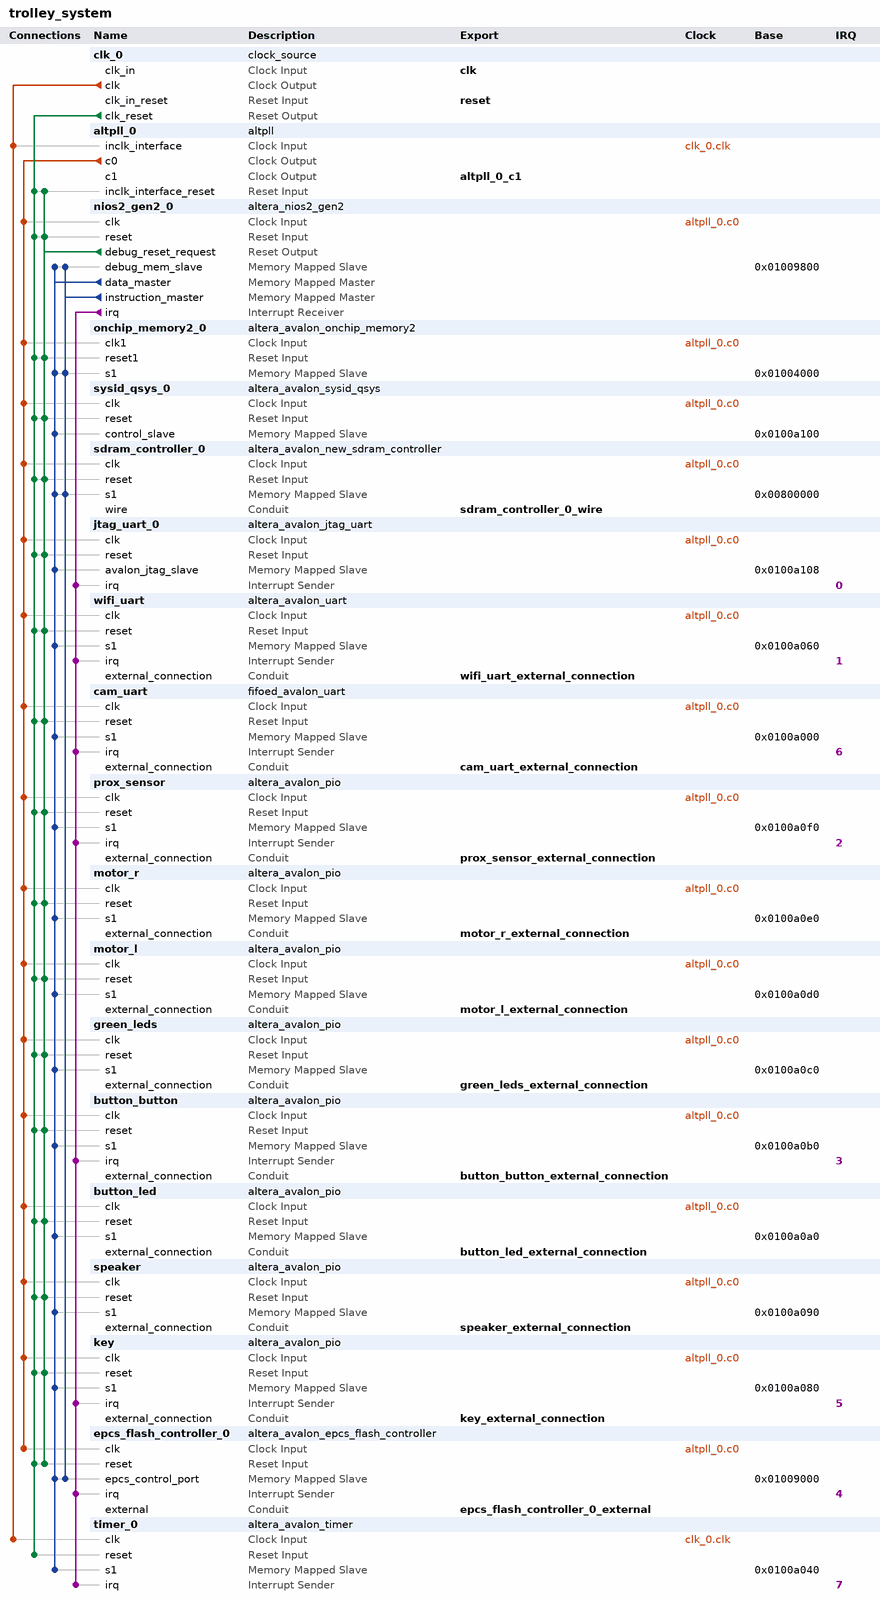
[diagram p0: system contents]
# Platform Designer (Qsys) system trolley_system, Cyclone IV E EP4CE22F17C6
# Parameters at their usual value, and those the tool derives, are not listed.
package require -exact qsys 16.1
create_system trolley_system
set_project_property DEVICE_FAMILY {Cyclone IV E}
set_project_property DEVICE EP4CE22F17C6

add_instance clk_0 clock_source 16.1
set_instance_parameter_value clk_0 clockFrequency 50000000

add_instance altpll_0 altpll 16.1
set_instance_parameter_value altpll_0 CLK0_DIVIDE_BY 1
set_instance_parameter_value altpll_0 CLK0_MULTIPLY_BY 1
set_instance_parameter_value altpll_0 CLK1_DIVIDE_BY 1
set_instance_parameter_value altpll_0 CLK1_DUTY_CYCLE 50
set_instance_parameter_value altpll_0 CLK1_MULTIPLY_BY 1
set_instance_parameter_value altpll_0 CLK1_PHASE_SHIFT -3000
set_instance_parameter_value altpll_0 COMPENSATE_CLOCK CLK1
set_instance_parameter_value altpll_0 INCLK0_INPUT_FREQUENCY 20000
set_instance_parameter_value altpll_0 PORT_ARESET PORT_UNUSED
set_instance_parameter_value altpll_0 PORT_LOCKED PORT_UNUSED
set_instance_parameter_value altpll_0 PORT_clk1 PORT_USED
set_instance_parameter_value altpll_0 PORT_clk2 PORT_UNUSED
set_instance_parameter_value altpll_0 PORT_clk3 PORT_UNUSED

add_instance nios2_gen2_0 altera_nios2_gen2 16.1
set_instance_parameter_value nios2_gen2_0 dcache_size 2048
set_instance_parameter_value nios2_gen2_0 exceptionSlave onchip_memory2_0.s1
set_instance_parameter_value nios2_gen2_0 icache_size 4096
set_instance_parameter_value nios2_gen2_0 impl Tiny
set_instance_parameter_value nios2_gen2_0 resetSlave epcs_flash_controller_0.epcs_control_port

add_instance onchip_memory2_0 altera_avalon_onchip_memory2 16.1
set_instance_parameter_value onchip_memory2_0 dataWidth 32
set_instance_parameter_value onchip_memory2_0 dualPort false
set_instance_parameter_value onchip_memory2_0 initMemContent true
set_instance_parameter_value onchip_memory2_0 initializationFileName onchip_mem.hex
set_instance_parameter_value onchip_memory2_0 memorySize 16384

add_instance sysid_qsys_0 altera_avalon_sysid_qsys 16.1
set_instance_parameter_value sysid_qsys_0 id 0

add_instance sdram_controller_0 altera_avalon_new_sdram_controller 16.1
set_instance_parameter_value sdram_controller_0 TAC 5.5
set_instance_parameter_value sdram_controller_0 TRCD 20.0
set_instance_parameter_value sdram_controller_0 TRP 20.0
set_instance_parameter_value sdram_controller_0 casLatency 3
set_instance_parameter_value sdram_controller_0 columnWidth 8
set_instance_parameter_value sdram_controller_0 dataWidth 16
set_instance_parameter_value sdram_controller_0 generateSimulationModel false
set_instance_parameter_value sdram_controller_0 model single_Micron_MT48LC4M32B2_7_chip
set_instance_parameter_value sdram_controller_0 numberOfBanks 4
set_instance_parameter_value sdram_controller_0 numberOfChipSelects 1
set_instance_parameter_value sdram_controller_0 powerUpDelay 100.0
set_instance_parameter_value sdram_controller_0 refreshPeriod 15.625
set_instance_parameter_value sdram_controller_0 rowWidth 12

add_instance jtag_uart_0 altera_avalon_jtag_uart 16.1
set_instance_parameter_value jtag_uart_0 simInteractiveOptions NO_INTERACTIVE_WINDOWS

add_instance wifi_uart altera_avalon_uart 16.1
set_instance_parameter_value wifi_uart baud 57600
set_instance_parameter_value wifi_uart dataBits 8
set_instance_parameter_value wifi_uart fixedBaud true
set_instance_parameter_value wifi_uart parity NONE
set_instance_parameter_value wifi_uart stopBits 1

add_instance cam_uart fifoed_avalon_uart 13.2
set_instance_parameter_value cam_uart add_error_bits false
set_instance_parameter_value cam_uart baud 57600
set_instance_parameter_value cam_uart dataBits 8
set_instance_parameter_value cam_uart driver_pass_error_bits false
set_instance_parameter_value cam_uart export_handshake false
set_instance_parameter_value cam_uart fifo_export_used false
set_instance_parameter_value cam_uart fifo_size_rx 512
set_instance_parameter_value cam_uart fifo_size_tx 8
set_instance_parameter_value cam_uart fixedBaud true
set_instance_parameter_value cam_uart gap_value 4
set_instance_parameter_value cam_uart hw_cts false
set_instance_parameter_value cam_uart parity NONE
set_instance_parameter_value cam_uart rx_IRQ_Threshold 1
set_instance_parameter_value cam_uart rx_fifo_LE false
set_instance_parameter_value cam_uart simInteractiveInputEnable false
set_instance_parameter_value cam_uart simInteractiveOutputEnable false
set_instance_parameter_value cam_uart simTrueBaud false
set_instance_parameter_value cam_uart stopBits 1
set_instance_parameter_value cam_uart syncRegDepth 2
set_instance_parameter_value cam_uart timeout_value 4
set_instance_parameter_value cam_uart timestamp_width 8
set_instance_parameter_value cam_uart trans_pin false
set_instance_parameter_value cam_uart tx_IRQ_Threshold 1
set_instance_parameter_value cam_uart tx_fifo_LE false
set_instance_parameter_value cam_uart useCtsRts false
set_instance_parameter_value cam_uart useEopRegister false
set_instance_parameter_value cam_uart useRelativePathForSimFile false
set_instance_parameter_value cam_uart use_ext_timestamp false
set_instance_parameter_value cam_uart use_gap_detection false
set_instance_parameter_value cam_uart use_rx_fifo true
set_instance_parameter_value cam_uart use_status_bit_clear false
set_instance_parameter_value cam_uart use_timestamp false
set_instance_parameter_value cam_uart use_timout false
set_instance_parameter_value cam_uart use_tx_fifo false

add_instance prox_sensor altera_avalon_pio 16.1
set_instance_parameter_value prox_sensor bitClearingEdgeCapReg true
set_instance_parameter_value prox_sensor captureEdge true
set_instance_parameter_value prox_sensor direction Input
set_instance_parameter_value prox_sensor generateIRQ true
set_instance_parameter_value prox_sensor irqType EDGE
set_instance_parameter_value prox_sensor width 1

add_instance motor_r altera_avalon_pio 16.1
set_instance_parameter_value motor_r direction Output
set_instance_parameter_value motor_r width 3

add_instance motor_l altera_avalon_pio 16.1
set_instance_parameter_value motor_l direction Output
set_instance_parameter_value motor_l width 3

add_instance green_leds altera_avalon_pio 16.1
set_instance_parameter_value green_leds direction Output
set_instance_parameter_value green_leds width 8

add_instance button_button altera_avalon_pio 16.1
set_instance_parameter_value button_button bitClearingEdgeCapReg true
set_instance_parameter_value button_button captureEdge true
set_instance_parameter_value button_button direction Input
set_instance_parameter_value button_button generateIRQ true
set_instance_parameter_value button_button irqType EDGE
set_instance_parameter_value button_button width 1

add_instance button_led altera_avalon_pio 16.1
set_instance_parameter_value button_led direction Output
set_instance_parameter_value button_led width 1

add_instance speaker altera_avalon_pio 16.1
set_instance_parameter_value speaker direction Output
set_instance_parameter_value speaker width 1

add_instance key altera_avalon_pio 16.1
set_instance_parameter_value key direction Input
set_instance_parameter_value key generateIRQ true
set_instance_parameter_value key width 1

add_instance epcs_flash_controller_0 altera_avalon_epcs_flash_controller 16.1
set_instance_parameter_value epcs_flash_controller_0 resetrequest_enabled true

add_instance timer_0 altera_avalon_timer 16.1
set_instance_parameter_value timer_0 period 1
set_instance_parameter_value timer_0 periodUnits MSEC

# connections
add_connection altpll_0.c0 button_button.clk clock
add_connection altpll_0.c0 button_led.clk clock
add_connection altpll_0.c0 cam_uart.clk clock
add_connection altpll_0.c0 epcs_flash_controller_0.clk clock
add_connection altpll_0.c0 green_leds.clk clock
add_connection altpll_0.c0 jtag_uart_0.clk clock
add_connection altpll_0.c0 key.clk clock
add_connection altpll_0.c0 motor_l.clk clock
add_connection altpll_0.c0 motor_r.clk clock
add_connection altpll_0.c0 nios2_gen2_0.clk clock
add_connection altpll_0.c0 onchip_memory2_0.clk1 clock
add_connection altpll_0.c0 prox_sensor.clk clock
add_connection altpll_0.c0 sdram_controller_0.clk clock
add_connection altpll_0.c0 speaker.clk clock
add_connection altpll_0.c0 sysid_qsys_0.clk clock
add_connection altpll_0.c0 wifi_uart.clk clock
add_connection clk_0.clk altpll_0.inclk_interface clock
add_connection clk_0.clk timer_0.clk clock
add_connection clk_0.clk_reset altpll_0.inclk_interface_reset reset
add_connection clk_0.clk_reset button_button.reset reset
add_connection clk_0.clk_reset button_led.reset reset
add_connection clk_0.clk_reset cam_uart.reset reset
add_connection clk_0.clk_reset epcs_flash_controller_0.reset reset
add_connection clk_0.clk_reset green_leds.reset reset
add_connection clk_0.clk_reset jtag_uart_0.reset reset
add_connection clk_0.clk_reset key.reset reset
add_connection clk_0.clk_reset motor_l.reset reset
add_connection clk_0.clk_reset motor_r.reset reset
add_connection clk_0.clk_reset nios2_gen2_0.reset reset
add_connection clk_0.clk_reset onchip_memory2_0.reset1 reset
add_connection clk_0.clk_reset prox_sensor.reset reset
add_connection clk_0.clk_reset sdram_controller_0.reset reset
add_connection clk_0.clk_reset speaker.reset reset
add_connection clk_0.clk_reset sysid_qsys_0.reset reset
add_connection clk_0.clk_reset timer_0.reset reset
add_connection clk_0.clk_reset wifi_uart.reset reset
add_connection nios2_gen2_0.debug_reset_request altpll_0.inclk_interface_reset reset
add_connection nios2_gen2_0.debug_reset_request button_button.reset reset
add_connection nios2_gen2_0.debug_reset_request button_led.reset reset
add_connection nios2_gen2_0.debug_reset_request cam_uart.reset reset
add_connection nios2_gen2_0.debug_reset_request epcs_flash_controller_0.reset reset
add_connection nios2_gen2_0.debug_reset_request green_leds.reset reset
add_connection nios2_gen2_0.debug_reset_request jtag_uart_0.reset reset
add_connection nios2_gen2_0.debug_reset_request key.reset reset
add_connection nios2_gen2_0.debug_reset_request motor_l.reset reset
add_connection nios2_gen2_0.debug_reset_request motor_r.reset reset
add_connection nios2_gen2_0.debug_reset_request nios2_gen2_0.reset reset
add_connection nios2_gen2_0.debug_reset_request onchip_memory2_0.reset1 reset
add_connection nios2_gen2_0.debug_reset_request prox_sensor.reset reset
add_connection nios2_gen2_0.debug_reset_request sdram_controller_0.reset reset
add_connection nios2_gen2_0.debug_reset_request speaker.reset reset
add_connection nios2_gen2_0.debug_reset_request sysid_qsys_0.reset reset
add_connection nios2_gen2_0.debug_reset_request wifi_uart.reset reset
add_connection nios2_gen2_0.data_master button_button.s1 avalon
set_connection_parameter_value nios2_gen2_0.data_master/button_button.s1 baseAddress 0x0100a0b0
add_connection nios2_gen2_0.data_master button_led.s1 avalon
set_connection_parameter_value nios2_gen2_0.data_master/button_led.s1 baseAddress 0x0100a0a0
add_connection nios2_gen2_0.data_master cam_uart.s1 avalon
set_connection_parameter_value nios2_gen2_0.data_master/cam_uart.s1 baseAddress 0x0100a000
add_connection nios2_gen2_0.data_master epcs_flash_controller_0.epcs_control_port avalon
set_connection_parameter_value nios2_gen2_0.data_master/epcs_flash_controller_0.epcs_control_port baseAddress 0x01009000
add_connection nios2_gen2_0.data_master green_leds.s1 avalon
set_connection_parameter_value nios2_gen2_0.data_master/green_leds.s1 baseAddress 0x0100a0c0
add_connection nios2_gen2_0.data_master jtag_uart_0.avalon_jtag_slave avalon
set_connection_parameter_value nios2_gen2_0.data_master/jtag_uart_0.avalon_jtag_slave baseAddress 0x0100a108
add_connection nios2_gen2_0.data_master key.s1 avalon
set_connection_parameter_value nios2_gen2_0.data_master/key.s1 baseAddress 0x0100a080
add_connection nios2_gen2_0.data_master motor_l.s1 avalon
set_connection_parameter_value nios2_gen2_0.data_master/motor_l.s1 baseAddress 0x0100a0d0
add_connection nios2_gen2_0.data_master motor_r.s1 avalon
set_connection_parameter_value nios2_gen2_0.data_master/motor_r.s1 baseAddress 0x0100a0e0
add_connection nios2_gen2_0.data_master nios2_gen2_0.debug_mem_slave avalon
set_connection_parameter_value nios2_gen2_0.data_master/nios2_gen2_0.debug_mem_slave baseAddress 0x01009800
add_connection nios2_gen2_0.data_master onchip_memory2_0.s1 avalon
set_connection_parameter_value nios2_gen2_0.data_master/onchip_memory2_0.s1 baseAddress 0x01004000
add_connection nios2_gen2_0.data_master prox_sensor.s1 avalon
set_connection_parameter_value nios2_gen2_0.data_master/prox_sensor.s1 baseAddress 0x0100a0f0
add_connection nios2_gen2_0.data_master sdram_controller_0.s1 avalon
set_connection_parameter_value nios2_gen2_0.data_master/sdram_controller_0.s1 baseAddress 0x00800000
add_connection nios2_gen2_0.data_master speaker.s1 avalon
set_connection_parameter_value nios2_gen2_0.data_master/speaker.s1 baseAddress 0x0100a090
add_connection nios2_gen2_0.data_master sysid_qsys_0.control_slave avalon
set_connection_parameter_value nios2_gen2_0.data_master/sysid_qsys_0.control_slave baseAddress 0x0100a100
add_connection nios2_gen2_0.data_master timer_0.s1 avalon
set_connection_parameter_value nios2_gen2_0.data_master/timer_0.s1 baseAddress 0x0100a040
add_connection nios2_gen2_0.data_master wifi_uart.s1 avalon
set_connection_parameter_value nios2_gen2_0.data_master/wifi_uart.s1 baseAddress 0x0100a060
add_connection nios2_gen2_0.instruction_master epcs_flash_controller_0.epcs_control_port avalon
set_connection_parameter_value nios2_gen2_0.instruction_master/epcs_flash_controller_0.epcs_control_port baseAddress 0x01009000
add_connection nios2_gen2_0.instruction_master nios2_gen2_0.debug_mem_slave avalon
set_connection_parameter_value nios2_gen2_0.instruction_master/nios2_gen2_0.debug_mem_slave baseAddress 0x01009800
add_connection nios2_gen2_0.instruction_master onchip_memory2_0.s1 avalon
set_connection_parameter_value nios2_gen2_0.instruction_master/onchip_memory2_0.s1 baseAddress 0x01004000
add_connection nios2_gen2_0.instruction_master sdram_controller_0.s1 avalon
set_connection_parameter_value nios2_gen2_0.instruction_master/sdram_controller_0.s1 baseAddress 0x00800000
add_connection nios2_gen2_0.irq button_button.irq interrupt
set_connection_parameter_value nios2_gen2_0.irq/button_button.irq irqNumber 3
add_connection nios2_gen2_0.irq cam_uart.irq interrupt
set_connection_parameter_value nios2_gen2_0.irq/cam_uart.irq irqNumber 6
add_connection nios2_gen2_0.irq epcs_flash_controller_0.irq interrupt
set_connection_parameter_value nios2_gen2_0.irq/epcs_flash_controller_0.irq irqNumber 4
add_connection nios2_gen2_0.irq jtag_uart_0.irq interrupt
set_connection_parameter_value nios2_gen2_0.irq/jtag_uart_0.irq irqNumber 0
add_connection nios2_gen2_0.irq key.irq interrupt
set_connection_parameter_value nios2_gen2_0.irq/key.irq irqNumber 5
add_connection nios2_gen2_0.irq prox_sensor.irq interrupt
set_connection_parameter_value nios2_gen2_0.irq/prox_sensor.irq irqNumber 2
add_connection nios2_gen2_0.irq timer_0.irq interrupt
set_connection_parameter_value nios2_gen2_0.irq/timer_0.irq irqNumber 7
add_connection nios2_gen2_0.irq wifi_uart.irq interrupt
set_connection_parameter_value nios2_gen2_0.irq/wifi_uart.irq irqNumber 1

# exported interfaces
add_interface altpll_0_c1 clock source
set_interface_property altpll_0_c1 EXPORT_OF altpll_0.c1
add_interface button_button_external_connection conduit end
set_interface_property button_button_external_connection EXPORT_OF button_button.external_connection
add_interface button_led_external_connection conduit end
set_interface_property button_led_external_connection EXPORT_OF button_led.external_connection
add_interface cam_uart_external_connection conduit end
set_interface_property cam_uart_external_connection EXPORT_OF cam_uart.external_connection
add_interface clk clock sink
set_interface_property clk EXPORT_OF clk_0.clk_in
add_interface epcs_flash_controller_0_external conduit end
set_interface_property epcs_flash_controller_0_external EXPORT_OF epcs_flash_controller_0.external
add_interface green_leds_external_connection conduit end
set_interface_property green_leds_external_connection EXPORT_OF green_leds.external_connection
add_interface key_external_connection conduit end
set_interface_property key_external_connection EXPORT_OF key.external_connection
add_interface motor_l_external_connection conduit end
set_interface_property motor_l_external_connection EXPORT_OF motor_l.external_connection
add_interface motor_r_external_connection conduit end
set_interface_property motor_r_external_connection EXPORT_OF motor_r.external_connection
add_interface prox_sensor_external_connection conduit end
set_interface_property prox_sensor_external_connection EXPORT_OF prox_sensor.external_connection
add_interface reset reset sink
set_interface_property reset EXPORT_OF clk_0.clk_in_reset
add_interface sdram_controller_0_wire conduit end
set_interface_property sdram_controller_0_wire EXPORT_OF sdram_controller_0.wire
add_interface speaker_external_connection conduit end
set_interface_property speaker_external_connection EXPORT_OF speaker.external_connection
add_interface wifi_uart_external_connection conduit end
set_interface_property wifi_uart_external_connection EXPORT_OF wifi_uart.external_connection

set_interconnect_requirement {$system} qsys_mm.clockCrossingAdapter HANDSHAKE
set_interconnect_requirement {$system} qsys_mm.enableEccProtection FALSE
set_interconnect_requirement {$system} qsys_mm.insertDefaultSlave FALSE
set_interconnect_requirement {$system} qsys_mm.maxAdditionalLatency 1

save_system trolley_system.qsys
